# EAGLE design peizo_board_PLA (EAGLE 9.0.0)
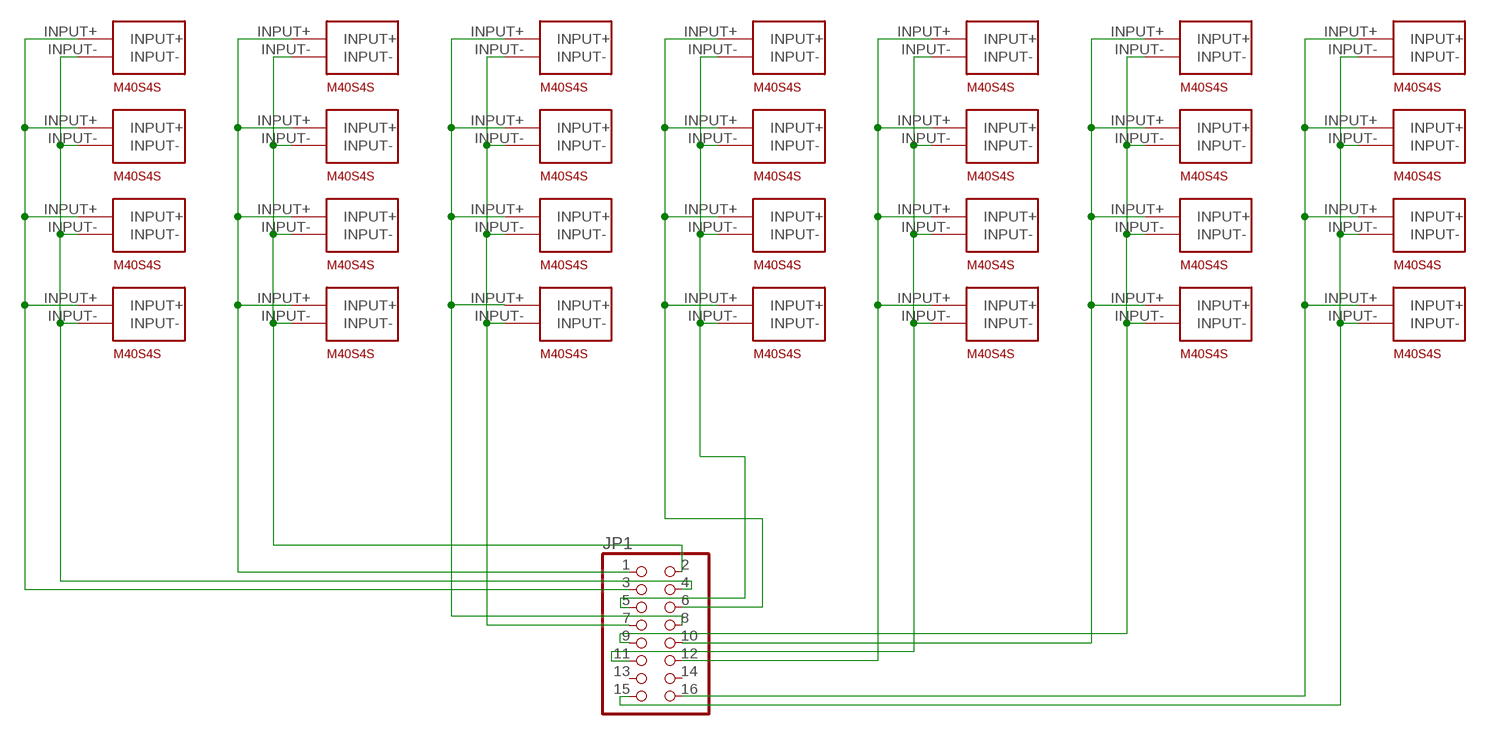
[diagram p0: schematic, sheet 1]

## Parts
JP1  PINHD-2X8  [2X08]
U$1  MA40S4S  [MA40S4S]
U$2  MA40S4S  [MA40S4S]
U$3  MA40S4S  [MA40S4S]
U$4  MA40S4S  [MA40S4S]
U$5  MA40S4S  [MA40S4S]
U$6  MA40S4S  [MA40S4S]
U$7  MA40S4S  [MA40S4S]
U$8  MA40S4S  [MA40S4S]
U$9  MA40S4S  [MA40S4S]
U$10  MA40S4S  [MA40S4S]
U$11  MA40S4S  [MA40S4S]
U$12  MA40S4S  [MA40S4S]
U$13  MA40S4S  [MA40S4S]
U$14  MA40S4S  [MA40S4S]
U$15  MA40S4S  [MA40S4S]
U$16  MA40S4S  [MA40S4S]
U$17  MA40S4S  [MA40S4S]
U$18  MA40S4S  [MA40S4S]
U$19  MA40S4S  [MA40S4S]
U$20  MA40S4S  [MA40S4S]
U$21  MA40S4S  [MA40S4S]
U$22  MA40S4S  [MA40S4S]
U$23  MA40S4S  [MA40S4S]
U$24  MA40S4S  [MA40S4S]
U$25  MA40S4S  [MA40S4S]
U$26  MA40S4S  [MA40S4S]
U$27  MA40S4S  [MA40S4S]
U$28  MA40S4S  [MA40S4S]

## Nets
N$1: JP1.4 U$1.INPUT- U$2.INPUT- U$3.INPUT- U$4.INPUT-
N$2: JP1.3 U$1.INPUT+ U$2.INPUT+ U$3.INPUT+ U$4.INPUT+
N$3: JP1.2 U$5.INPUT- U$6.INPUT- U$7.INPUT- U$8.INPUT-
N$4: JP1.1 U$5.INPUT+ U$6.INPUT+ U$7.INPUT+ U$8.INPUT+
N$5: JP1.7 U$9.INPUT- U$10.INPUT- U$11.INPUT- U$12.INPUT-
N$6: JP1.8 U$9.INPUT+ U$10.INPUT+ U$11.INPUT+ U$12.INPUT+
N$7: JP1.5 U$13.INPUT- U$14.INPUT- U$15.INPUT- U$16.INPUT-
N$8: JP1.6 U$13.INPUT+ U$14.INPUT+ U$15.INPUT+ U$16.INPUT+
N$9: JP1.11 U$17.INPUT- U$18.INPUT- U$19.INPUT- U$20.INPUT-
N$10: JP1.12 U$17.INPUT+ U$18.INPUT+ U$19.INPUT+ U$20.INPUT+
N$11: JP1.9 U$21.INPUT- U$22.INPUT- U$23.INPUT- U$24.INPUT-
N$12: JP1.10 U$21.INPUT+ U$22.INPUT+ U$23.INPUT+ U$24.INPUT+
N$13: JP1.15 U$25.INPUT- U$26.INPUT- U$27.INPUT- U$28.INPUT-
N$14: JP1.16 U$25.INPUT+ U$26.INPUT+ U$27.INPUT+ U$28.INPUT+
Unconnected: JP1.13 JP1.14

## Library data of the parts
JP1 = pinhead:PINHD-2X8: PIN HEADER
U$1-U$28 = MA40S4S:MA40S4S

## Board
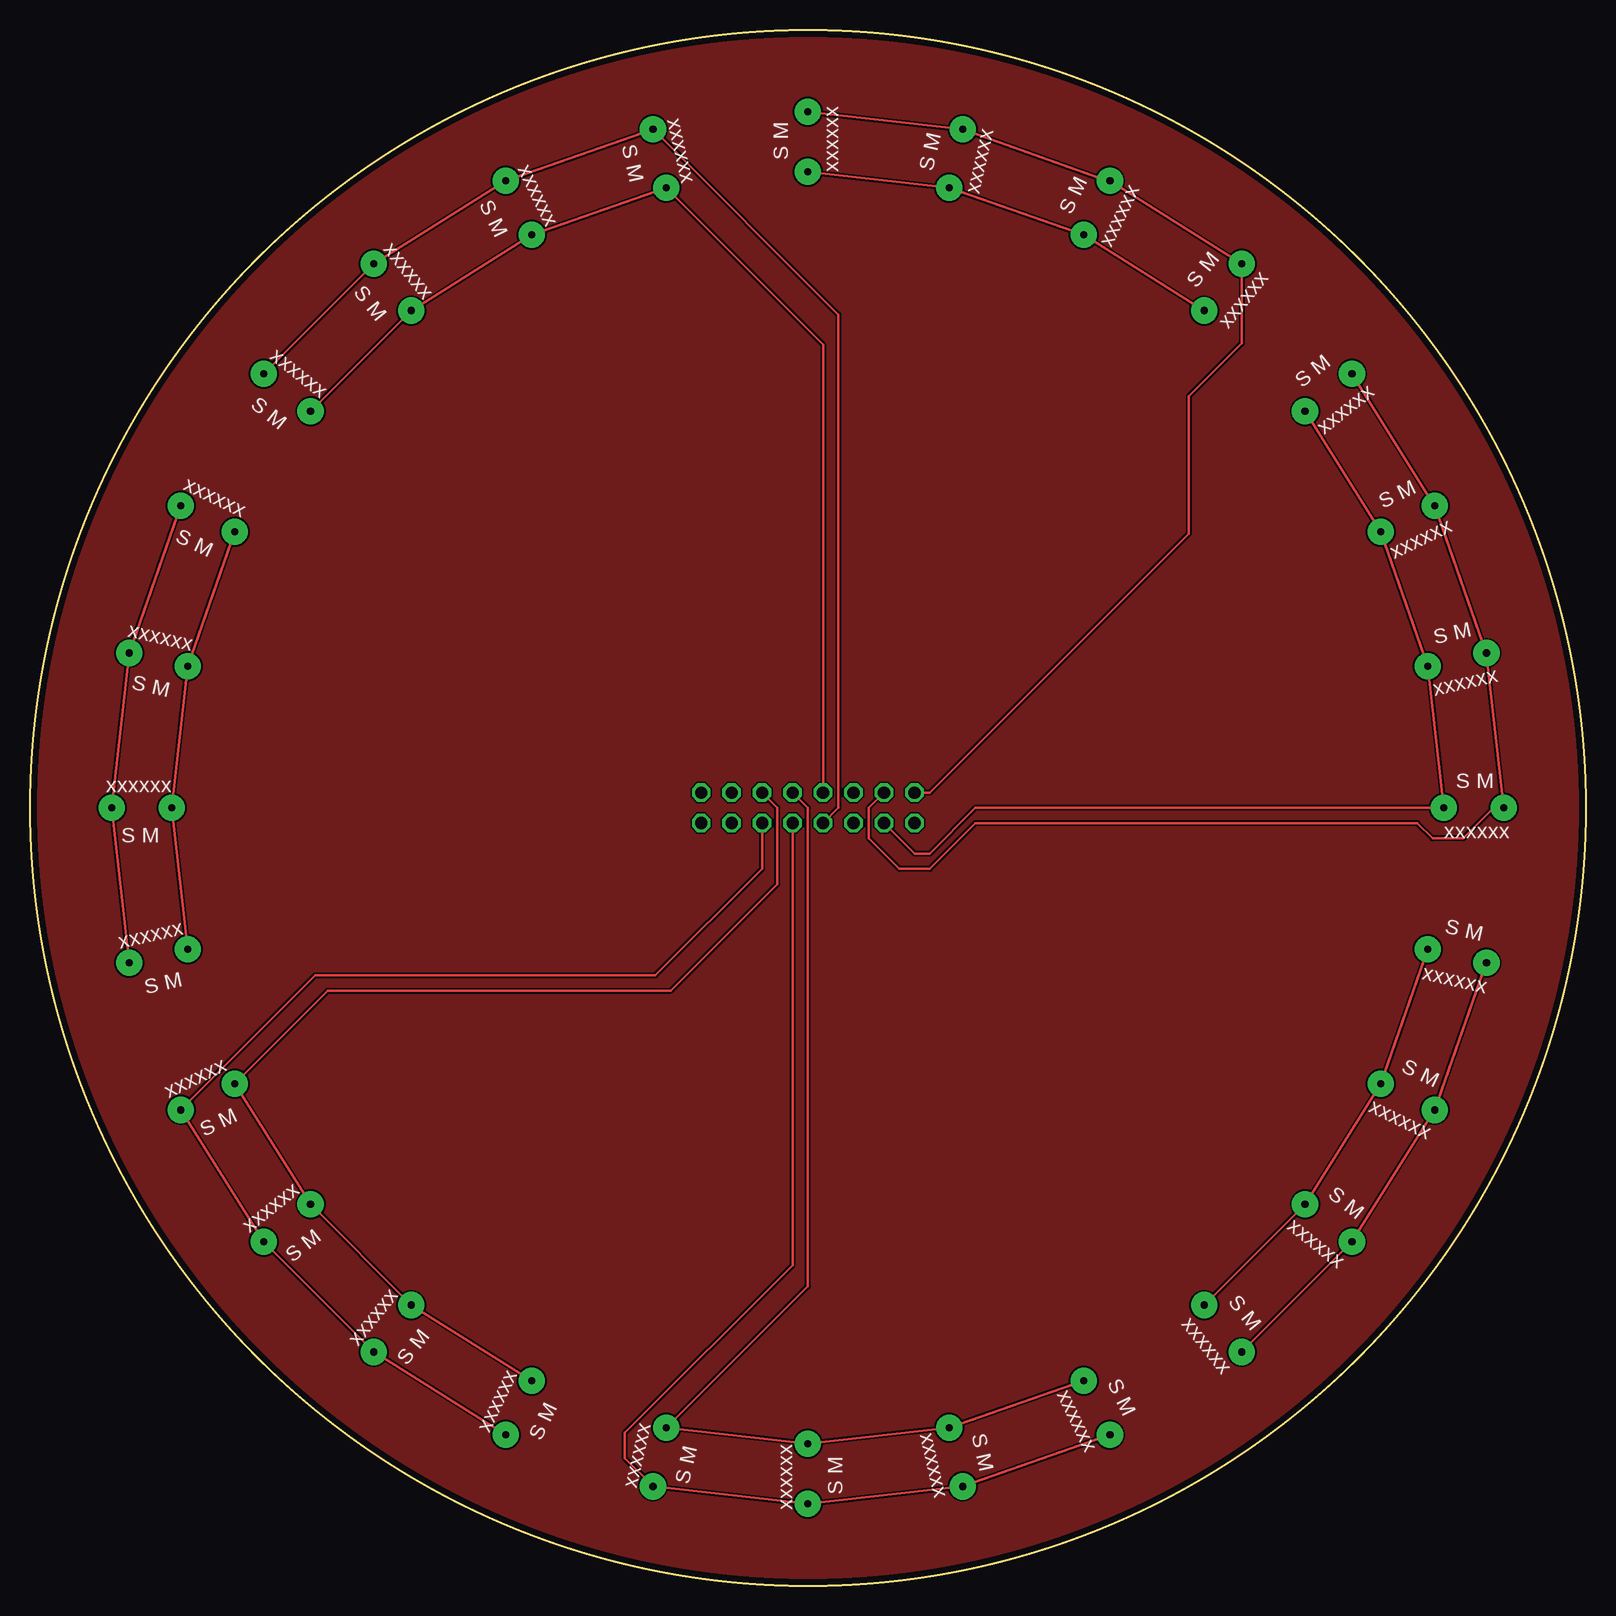
[diagram p1: board, top side]
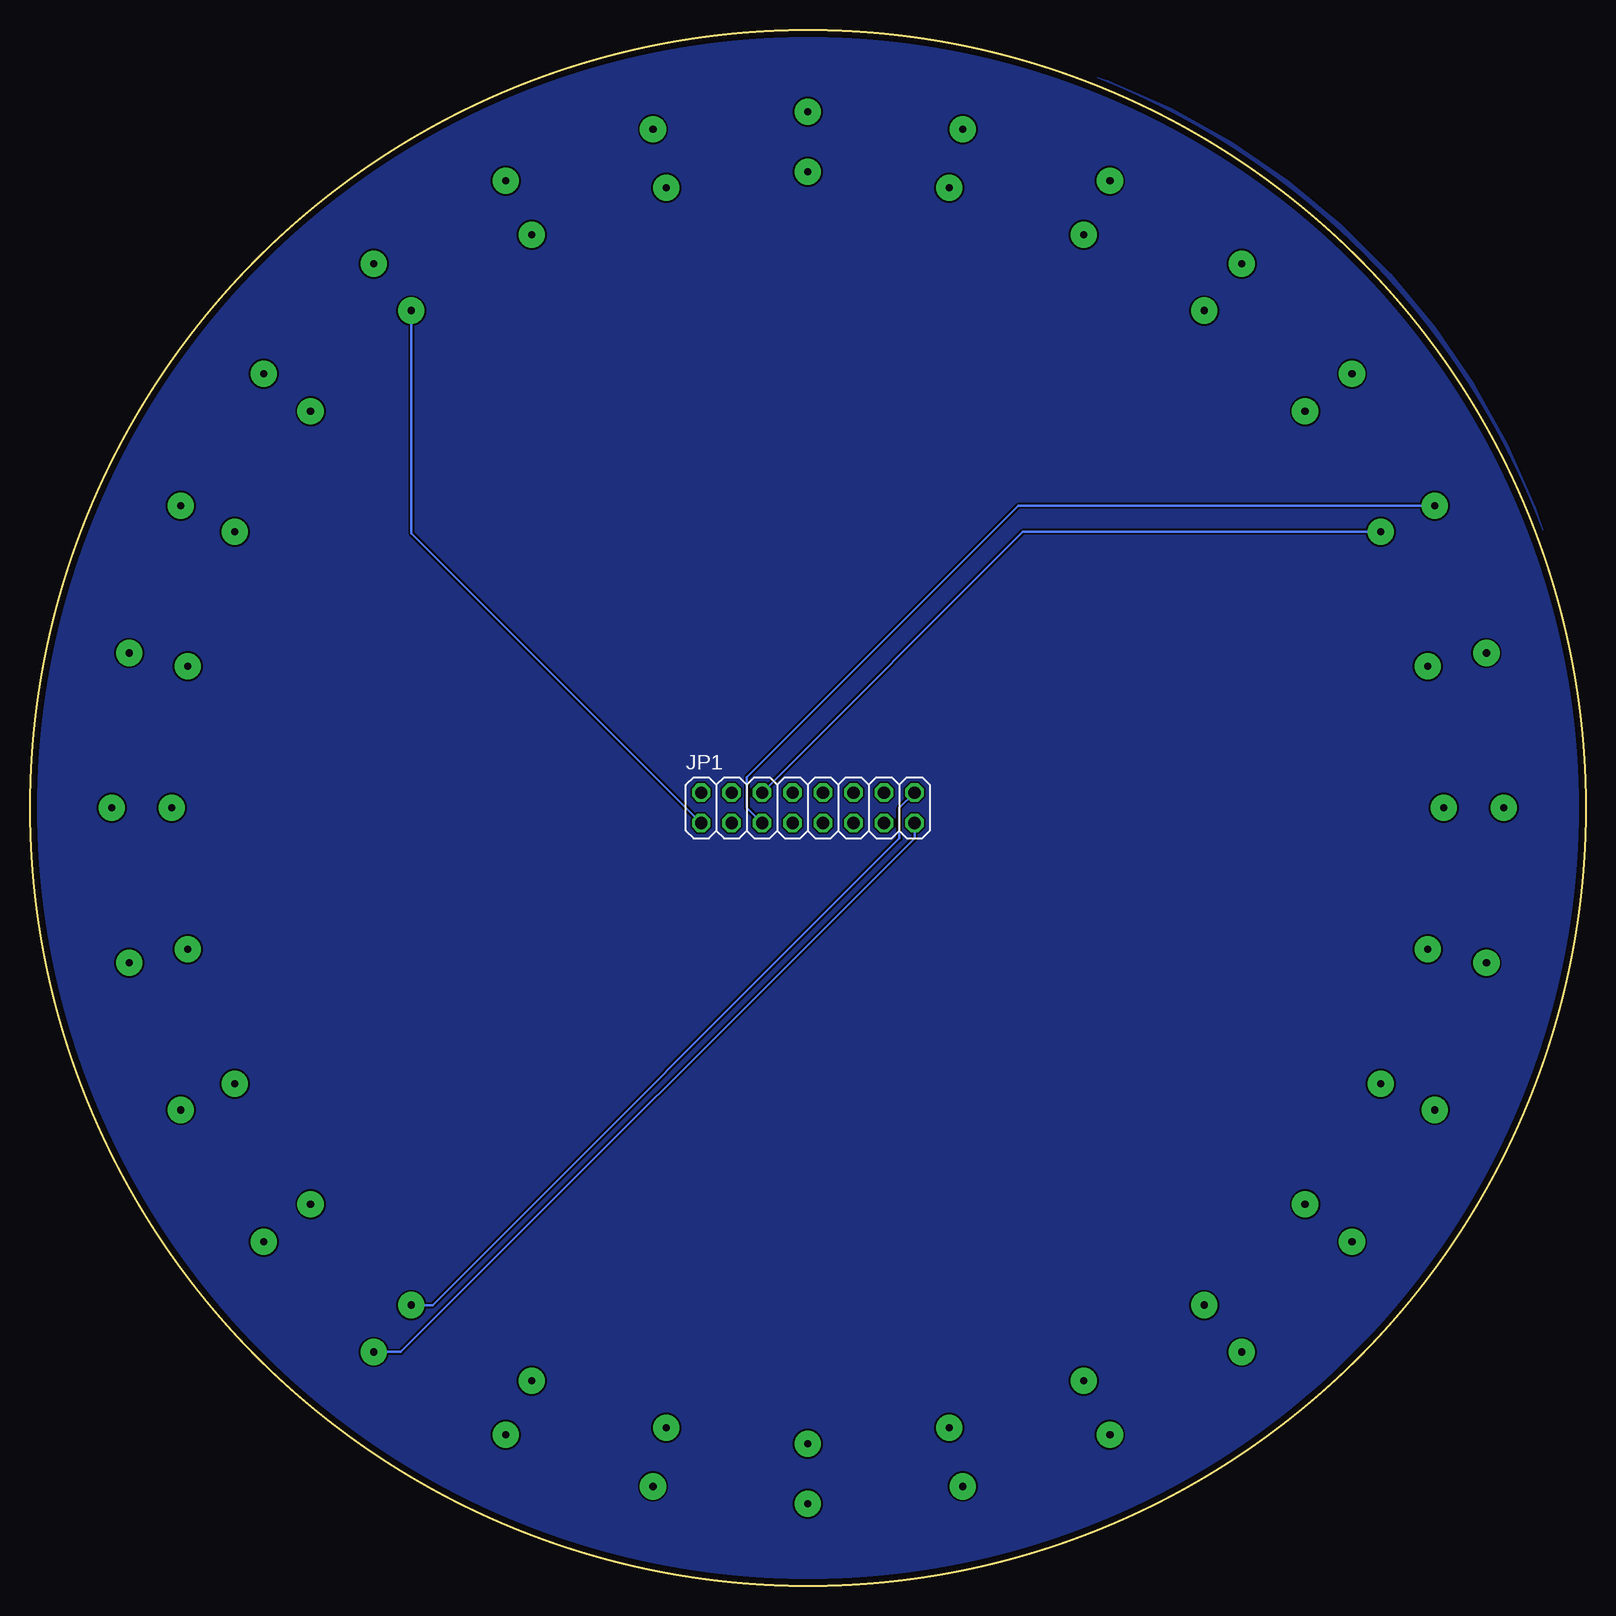
[diagram p2: board, bottom side, seen from below]

Size 129.64 x 129.64 mm. Coordinates in mm from the lower left corner, seen from the top.
Outline: circle at 64.82,64.82 radius 64.82
Copper layers (1*16): Top 0.035mm / dielectric 1.6mm / Bottom 0.035mm
Design rules "Elecrow_2-layer_PCB_eagle_rule *": minimum track width 6mil, minimum drill 12mil, track to track 6mil, track to pad 6mil, pad to pad 6mil, via to via 8mil, smd to smd 0mil, copper to edge 20mil, drill to drill 10mil, minimum pad ring 6mil, minimum via ring 6mil, stop-mask expansion 0mil, vias tented up to drill 100mil, thermal gap 10mil

### Footprints (pad centres in the part's own frame; a part is rotated, then mirrored left to right if it is on the bottom)
2X08 = drill 1.016 octagon: 1 -8.89,-1.27; 2 -8.89,1.27; 3 -6.35,-1.27; 4 -6.35,1.27; 5 -3.81,-1.27; 6 -3.81,1.27; 7 -1.27,-1.27; 8 -1.27,1.27; 9 1.27,-1.27; 10 1.27,1.27; 11 3.81,-1.27; 12 3.81,1.27; 13 6.35,-1.27; 14 6.35,1.27; 15 8.89,-1.27; 16 8.89,1.27
MA40S4S = drill 0.6 pad 2.184: INPUT+ 0,0; INPUT- 5,0

### Placement (x,y rotation side)
JP1  64.82,64.82 0 bottom
U$1  117.82,64.82 0 top
U$2  116.49,76.61 12.8 top
U$3  112.57,87.82 25.8 top
U$4  106.26,97.86 38.6 top
U$5  97.86,106.26 51.4 top
U$6  87.82,112.57 64.2 top
U$7  76.61,116.49 77.2 top
U$8  64.82,117.82 90 top
U$9  53.03,116.49 102.8 top
U$10  41.82,112.57 115.8 top
U$11  31.77,106.26 128.6 top
U$12  23.38,97.86 141.4 top
U$13  17.07,87.82 154.2 top
U$14  13.15,76.61 167.2 top
U$15  11.82,64.82 180 top
U$16  13.15,53.03 192.8 top
U$17  17.07,41.82 205.8 top
U$18  23.38,31.77 218.6 top
U$19  31.77,23.38 231.4 top
U$20  41.82,17.07 244.2 top
U$21  53.03,13.15 257.2 top
U$22  64.82,11.82 270 top
U$23  76.61,13.15 282.8 top
U$24  87.82,17.07 295.8 top
U$25  97.86,23.38 308.6 top
U$26  106.26,31.77 321.4 top
U$27  112.57,41.82 334.2 top
U$28  116.49,53.03 347.2 top

### Tracks (layer width: path | path; a pad name or v marks a point on that pad's centre or on a via)
N$1
  Top 0.203: U$4.INPUT- 116.89,90.22 U$3.INPUT- U$2.INPUT- U$1.INPUT- 121.97,64.82 119.43,62.28 116.89,62.28 115.62,63.55 78.79,63.55 74.98,59.74 72.44,59.74 69.9,62.28 69.9,64.82 JP1.4
N$2
  Top 0.203: U$4.INPUT+ U$3.INPUT+ U$2.INPUT+ U$1.INPUT+ 78.79,64.82 74.98,61.01 73.71,61.01 JP1.3
N$3
  Top 0.203: U$8.INPUT- U$7.INPUT- 90.22,116.89 U$6.INPUT- U$5.INPUT- 100.98,103.52 96.57,99.11 96.57,87.68 74.98,66.09 JP1.2
N$4
  Top 0.203: U$8.INPUT+ U$7.INPUT+ U$6.INPUT+ U$5.INPUT+
  Bottom 0.203: U$5.INPUT+ 97.86,87.7 JP1.1
N$5
  Top 0.203: U$12.INPUT- U$11.INPUT- U$10.INPUT- U$9.INPUT- 67.36,105.93 67.36,64.82 JP1.7
N$6
  Top 0.203: U$12.INPUT+ U$11.INPUT+ U$10.INPUT+ U$9.INPUT+ 66.09,103.43 JP1.8
N$7
  Top 0.203: U$16.INPUT- U$15.INPUT- U$14.INPUT- U$13.INPUT-
  Bottom 0.203: U$13.INPUT- 47.27,89.99 69.9,67.36 69.9,64.82 JP1.5
N$8
  Top 0.203: U$16.INPUT+ U$15.INPUT+ U$14.INPUT+ U$13.INPUT+
  Bottom 0.203: U$13.INPUT+ 46.9,87.82 JP1.6
N$9
  Top 0.203: U$20.INPUT- U$19.INPUT- U$18.INPUT- U$17.INPUT- 23.77,50.85 52.12,50.85 61.01,59.74 JP1.11
N$10
  Top 0.203: U$20.INPUT+ U$19.INPUT+ U$18.INPUT+ U$17.INPUT+ 24.82,49.58 53.39,49.58 62.28,58.47 62.28,64.82 JP1.12
N$11
  Top 0.203: U$24.INPUT- U$23.INPUT- U$22.INPUT- U$21.INPUT- 49.58,10.61 49.58,12.75 63.55,26.72 JP1.9
N$12
  Top 0.203: U$24.INPUT+ U$23.INPUT+ U$22.INPUT+ U$21.INPUT+ 64.82,24.94 64.82,64.82 JP1.10
N$13
  Top 0.203: U$25.INPUT- U$26.INPUT- U$27.INPUT- U$28.INPUT-
  Bottom 0.203: U$25.INPUT- 98.73,19.47 55.93,62.28 JP1.15
N$14
  Top 0.203: U$28.INPUT+ U$27.INPUT+ U$26.INPUT+ U$25.INPUT+
  Bottom 0.203: U$25.INPUT+ 96.1,23.38 57.2,62.28 57.2,64.82 JP1.16
N$15
  pour Top: 64.82,0.05 arc90 129.59,64.82 arc90 64.82,129.59 arc90 0.05,64.82 arc90
N$16
  pour Bottom: 66.09,0.05 arc90 129.59,63.55 arc90 63.55,129.59 62.28,129.59 arc90 0.05,67.36 0.05,66.09 arc90